# Altium project 3P_JST-XH_EXT.PrjPcb
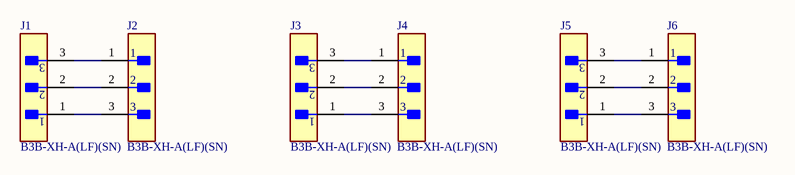
[diagram p0: 3P_JST-XH_EXT.SchDoc]
1 sheet, 6 parts. Net scope: global (net labels, ports and power ports of the same name join across sheets).
Board file: 3P_JST-XH_EXT.PcbDoc

## Sheet 3P_JST-XH_EXT.SchDoc
size A4

### Parts
J1  B3B-XH-A(LF)(SN)  [FP-B3B-XH-A_LF_SN-MFG]
J2  B3B-XH-A(LF)(SN)  [FP-B3B-XH-A_LF_SN-MFG]
J3  B3B-XH-A(LF)(SN)  [FP-B3B-XH-A_LF_SN-MFG]
J4  B3B-XH-A(LF)(SN)  [FP-B3B-XH-A_LF_SN-MFG]
J5  B3B-XH-A(LF)(SN)  [FP-B3B-XH-A_LF_SN-MFG]
J6  B3B-XH-A(LF)(SN)  [FP-B3B-XH-A_LF_SN-MFG]

### Nets
NetJ1_1: J1.1 J2.3
NetJ1_2: J1.2 J2.2
NetJ1_3: J1.3 J2.1
NetJ3_1: J3.1 J4.3
NetJ3_2: J3.2 J4.2
NetJ3_3: J3.3 J4.1
NetJ5_1: J5.1 J6.3
NetJ5_2: J5.2 J6.2
NetJ5_3: J5.3 J6.1

### Library data of the parts
J1-J6 = CMP-17439-000014-1: CONN HEADER VERT 3POS 2.5MM; Manufacturer: JST; Conn Gender: Male; Conn Orientation: Vertical; Voltage Rating: 250V; Number Of Contacts: 3; Current Rating: 3A; Contact Material: Tin,Copper; Temperature Range Low: -25°C; Octopart: https://octopart.com/b3b-xh-a%28lf%29%28sn%29-jst-3990185; Device Class L3: unset; Device Class L1: Connectors; Lead Free: Yes; Temperature: -25°C to +85°C; Manufacturer Part Number: B3B-XH-A(LF)(SN); Package: 0; ComponentLink2Description: Datasheet; Pitch: 2.5mm; RoHS: TRUE; Category: Conn; Automotive: No; Temperature Range High: +85°C; Height: 7mm; Device Class L2: Headers and Wire Housings; Number Of Rows: 1; Digikey Description: CONN HEADER VERT 3POS 2.5MM; ComponentLink2URL: https://www.jst-mfg.com/product/pdf/eng/eXH.pdf